# Altium schematic sheet MCU.SchDoc: VFD-Clock
size A; Author: Jack Danielski
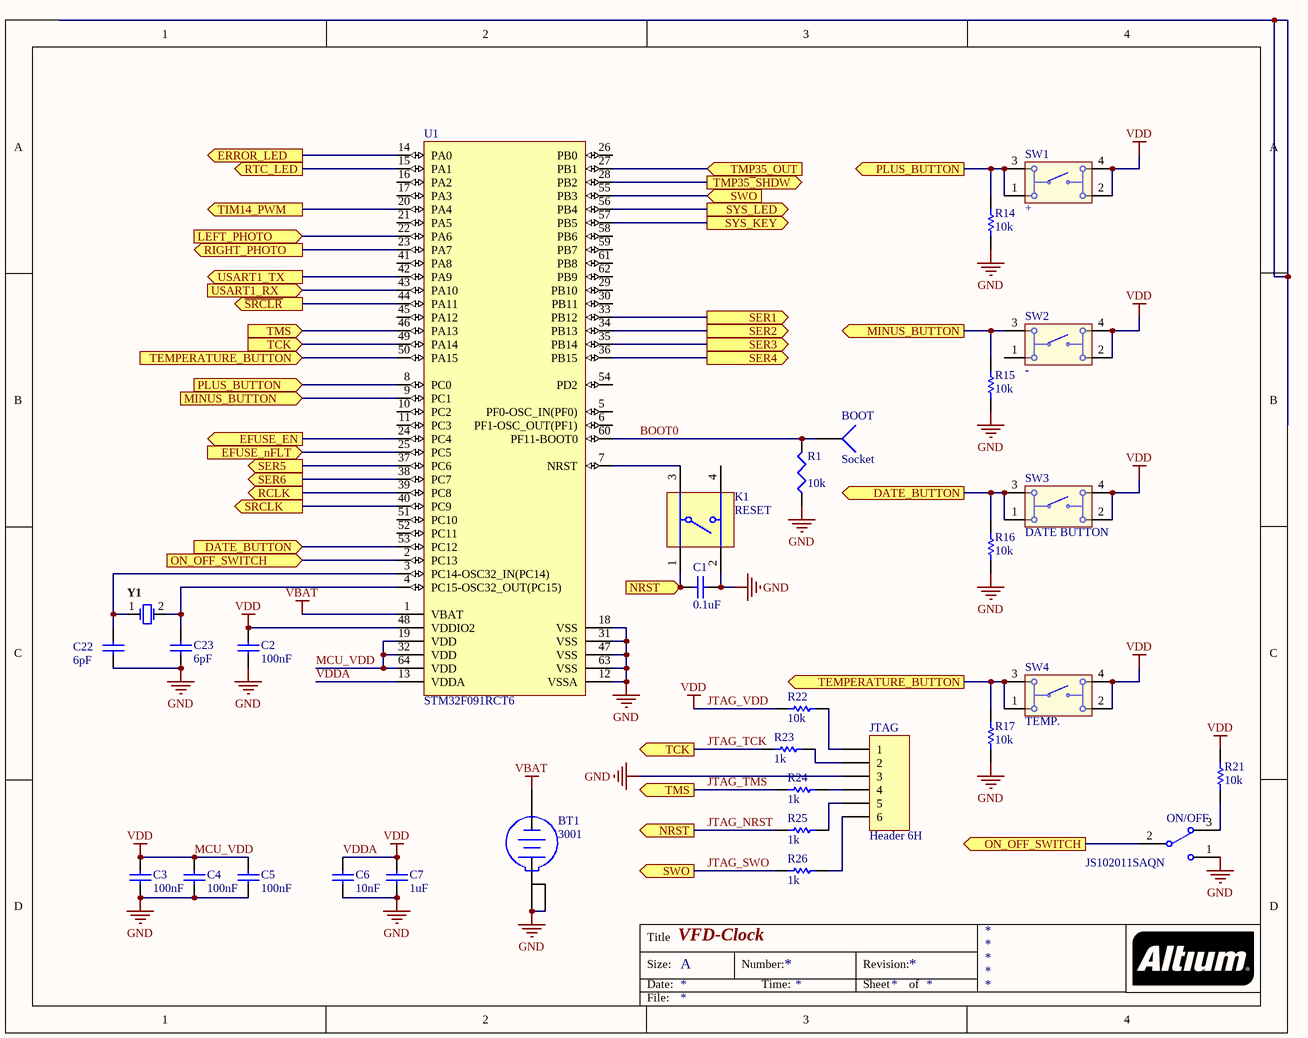
[diagram p0: MCU.SchDoc]

## Parts
BOOT  Socket  [PIN1]
BT1  3001  [KSTN-3001_V]
C1  0.1uF  [CAPC1608X90X40ML10T20]
C2  100nF  [CAPC1608X90X40ML10T20]
C3  100nF  [CAPC1608X90X40ML10T20]
C4  100nF  [CAPC1608X90X40ML10T20]
C5  100nF  [CAPC1608X90X40ML10T20]
C6  10nF  [CAPC1608X90X40ML10T20]
C7  1uF  [CAPC1608X90X20LL10]
C22  6pF  [CAPC1608X90X40ML10T20]
C23  6pF  [CAPC1608X90X40ML10T20]
JTAG  Header 6H  [HDR1X6H]
K1  RESET  [PNSC-EVPAA_V]
ON/OFF  JS102011SAQN  [CKCP-JS102011SAQN-3_V]
R1  value 10k  [J1-0603]
R14  10k  [RESC1608X55X30LL20T20]
R15  10k  [RESC1608X55X30LL20T20]
R16  10k  [RESC1608X55X30LL20T20]
R17  10k  [RESC1608X55X30LL20T20]
R21  10k  [RESC1608X55X30LL20T20]
R22  10k  [RESC1608X55X30LL20T20]
R23  1k  [RESC1608X55X30LL20T20]
R24  1k  [RESC1608X55X30LL20T20]
R25  1k  [RESC1608X55X30LL20T20]
R26  1k  [RESC1608X55X30LL20T20]
SW1  +  [434331045822]
SW2  -  [434331045822]
SW3  DATE BUTTON  [434331045822]
SW4  TEMP.  [434331045822]
U1  STM32F091RCT6  [STM-LQFP64_L]
Y1  ABS07-120-32.768KHZ-T  [ABRA-ABS07_A_V]  (value not drawn)

## Ports
DATE_BUTTON (in), DATE_BUTTON (out), EFUSE_EN (out), EFUSE_nFLT (in), ERROR_LED (out), LEFT_PHOTO (in), MINUS_BUTTON (in), MINUS_BUTTON (out), NRST (in), NRST (out), ON_OFF_SWITCH (in), ON_OFF_SWITCH (out), PLUS_BUTTON (in), PLUS_BUTTON (out), RCLK (out), RIGHT_PHOTO (out), RTC_LED (out), SER1 (out), SER2 (out), SER3 (out), SER4 (out), SER5 (out), SER6 (out), SRCLK (out), SWO (in), SWO (out), SYS_KEY (out), SYS_LED (out), TCK (in), TCK (out), TEMPERATURE_BUTTON (in), TEMPERATURE_BUTTON (out), TIM14_PWM (out), TMP35_OUT (in), TMP35~{_}SHDW (out), TMS (in), TMS (out), USART1_RX (in), USART1_TX (out), ~{SRCLR} (out)

## Nets
GND: BT1.1(+) BT1.2(+) C1.2 C2.1 C3.1 C4.1 C5.1 C6.2 C7.1 C22.1 C23.1 JTAG.3 K1.2(B) ON/OFF.1 R1.1 R14.1 R15.1 R16.1 R17.1 U1.12(VSSA) U1.18(VSS) U1.31(VSS) U1.47(VSS) U1.63(VSS)
JTAG_VDD: C2.2 C3.2 C4.2 C5.2 C6.1 C7.2 R21.2 R22.2 SW1.2 SW1.4 SW2.2 SW2.4 SW3.2 SW3.4 SW4.2 SW4.4 U1.13(VDDA) U1.19(VDD) U1.32(VDD) U1.48(VDDIO2) U1.64(VDD)  [also labelled MCU_VDD, VDD, VDDA]
VBAT: BT1.3(-) U1.1(VBAT)
~{SRCLR}: U1.44(PA11) ; port ~{SRCLR}
BOOT0: BOOT.1 R1.2 U1.60(PF11-BOOT0)
DATE_BUTTON: R16.2 SW3.1 SW3.3 U1.53(PC12) ; port DATE_BUTTON
EFUSE_EN: U1.24(PC4) ; port EFUSE_EN
EFUSE_nFLT: U1.25(PC5) ; port EFUSE_nFLT
ERROR_LED: U1.14(PA0) ; port ERROR_LED
JTAG_NRST: C1.1 K1.1(A) R25.2 ; port NRST
JTAG_SWO: R26.2 U1.55(PB3) ; port SWO
JTAG_TCK: R23.2 U1.49(PA14) ; port TCK
JTAG_TMS: R24.2 U1.46(PA13) ; port TMS
LEFT_PHOTO: U1.22(PA6) ; port LEFT_PHOTO
MINUS_BUTTON: R15.2 SW2.3 U1.9(PC1) ; port MINUS_BUTTON
ON_OFF_SWITCH: ON/OFF.2 U1.2(PC13) ; port ON_OFF_SWITCH
PLUS_BUTTON: R14.2 SW1.1 SW1.3 U1.8(PC0) ; port PLUS_BUTTON
RCLK: U1.39(PC8) ; port RCLK
RIGHT_PHOTO: U1.23(PA7) ; port RIGHT_PHOTO
RTC_LED: U1.15(PA1) ; port RTC_LED
SER1: U1.33(PB12) ; port SER1
SER2: U1.34(PB13) ; port SER2
SER3: U1.35(PB14) ; port SER3
SER4: U1.36(PB15) ; port SER4
SER5: U1.37(PC6) ; port SER5
SER6: U1.38(PC7) ; port SER6
SRCLK: U1.40(PC9) ; port SRCLK
SYS_KEY: U1.57(PB5) ; port SYS_KEY
SYS_LED: U1.56(PB4) ; port SYS_LED
TEMPERATURE_BUTTON: R17.2 SW4.1 SW4.3 U1.50(PA15) ; port TEMPERATURE_BUTTON
TIM14_PWM: U1.20(PA4) ; port TIM14_PWM
TMP35~{_}SHDW: U1.28(PB2) ; port TMP35~{_}SHDW
TMP35_OUT: U1.27(PB1) ; port TMP35_OUT
USART1_RX: U1.43(PA10) ; port USART1_RX
USART1_TX: U1.42(PA9) ; port USART1_TX
NetC22_2: C22.2 U1.3(PC14-OSC32_IN(PC14)) Y1.1
NetC23_2: C23.2 U1.4(PC15-OSC32_OUT(PC15)) Y1.2
NetJTAG_1: JTAG.1 R22.1
NetJTAG_2: JTAG.2 R23.1
NetJTAG_4: JTAG.4 R24.1
NetJTAG_5: JTAG.5 R25.1
NetJTAG_6: JTAG.6 R26.1
NetK1_3: K1.3(A') U1.7(NRST)
NetON/OFF_3: ON/OFF.3 R21.1

Not connected (* = marked no-connect by the designer): K1 4(B'); SW2 1; U1 5(PF0-OSC_IN(PF0)) 6(PF1-OSC_OUT(PF1)) 10(PC2) 11(PC3) 16(PA2) 17(PA3) 21(PA5) 26(PB0) 29(PB10) 30(PB11) 41(PA8) 45(PA12) 51(PC10) 52(PC11) 54(PD2) 58(PB6) 59(PB7) 61(PB8) 62(PB9)

## Notes on the sheet
- Title
- Size:
- Date:
- A
- Number:
- Time:
- Revision:
- Sheet
- of
- File:

## Library data of the parts
BT1 = CMP-2000-05463-1: Holder Battery Coin, 12 mm, 2-Pin THD, RoHS; Manufacturer: Keystone; Package Reference: 3001; Package Description: 2-Pin Through Hole Device, Body 13.21 x 12.07 mm; Datasheet Version: Rev. H, 09/2006; Datasheet URL: https://datasheet.ciiva.com/3/3001-3954.pdf; Mounting Technology: ThroughHole; Manufacturer URL: http://www.keyelco.com/
C1-C5 C22 C23 = CMP-2000-05002-1: Ceramic Multilayer Capacitor, 100 nF, +/- 10%, 50 V, -55 to 155 degC, 0603 (1608 Metric), RoHS, Tape and Reel; Manufacturer: Yageo; Online Catalog: CCSeries; Voltage - Rated: 16V; Product Training Modules: MultilayerCeramicCapacitors; Other Names: 311-1088-6; Featured Product: CommodityMultilayerCeramicCapacitors–CCSeries; Capacitance: 0.1µF; Temperature Coefficient: X7R; Height - Seated (Max): -; Operating Temperature: -55degC~125degC; Package / Case: 0603(1608Metric); Datasheet URL: https://datasheet.ciiva.com/11786/0900766b80d84f1d-11786077.pdf; Package Description: 2-Pin Surface Mount Device, Body 1.6 x 0.8 mm; Family: CeramicCapacitors; Packaging: Digi-Reel; Size / Dimension: 0.063"Lx0.031"W(1.60mmx0.80mm); Thickness (Max): 0.035"(0.90mm); Series: CC; Lead Spacing: -; Features: -; Tolerance: ±10%; Lead Style: -; Ratings: -; Manufacturer URL: http://www.yageo.com/; Package Reference: 603; Standard Package: 1; Category: Capacitors; Mounting Type: SurfaceMount,MLCC; Applications: GeneralPurpose; Datasheet Version: Rev. 2, 05/2009
C6 = CMP-2100-03600-1: Chip Capacitor, 10 nF, +/- 10%, 50 V, -55 to 125 degC, 0603 (1608 Metric), RoHS, Tape and Reel; Manufacturer: Yageo; Insulation Resistance: 100GR; Dielectric: X7R; Voltage Rating (DC): 50V; Material: Ceramic; Lead Free: LeadFree; Case/Package: 0603; Datasheet Version: Rev. 15, 10/2016; Composition: Ceramic; Radiation Hardening: No; Thickness: 0.035inch; RoHSCompliant: True; Termination: SMD/SMT; Capacitance: 10nF; Manufacturer URL: http://www.yageo.com/; Tolerance: 10%; REACH SVHC: NoSVHC; Voltage: 50V; Max Operating Temperature: 125degC; Case Code (Metric): 1608; Package Quantity: 1; Case Code (Imperial): 0603; Packaging: TapeandReel; Package Reference: 0603; Width: 0.031inch; Datasheet URL: http://www.yageo.com/documents/recent/UPY-GPHC_X7R_6.3V-to-50V_15.pdf; Length: 1.6mm; Min Operating Temperature: -55degC; Number of Pins: 2; Depth: 0.8mm; Mount: SurfaceMount; Height: 0.8mm; Voltage Rating: 50V; Package Description: 2-Pin Surface Mount Device, Body 1.6 x 0.8 mm
C7 = CMP-2000-06025-1: Chip Capacitor, 1 uF, +/- 10%, 50 V, -55 to 85 degC, 0603 (1608 Metric), RoHS, Tape and Reel; Manufacturer: TDK; PCN Part Number: MLCCPartNumberChange30/Nov/2012; Other Names: 445-7468-6; Online Catalog: CSeries,GeneralPurpose; Capacitance: 1µF; Product Training Modules: CSeriesGeneralApplicationsSEAT,CCV,andTVCLDesignToolsGuidetoReplacinganElectrolyticCapacitorwithanMLCC; Voltage - Rated: 50V; Design Resources: 20WNon-IsolatedBuckLEDDriverUsingPLLNK460KG; Temperature Coefficient: X5R; Series: C; Datasheet Version: 08/2016; Package Description: 2-Pin Surface Mount Device, Body 1.6 x 0.8 mm; Mounting Technology: SurfaceMount; Features: -; Size / Dimension: 0.063"Lx0.031"W(1.60mmx0.80mm); Lead Spacing: -; Operating Temperature: -55°C~85°C; Tolerance: ±10%; Height - Seated (Max): -; Mounting Type: SurfaceMount,MLCC; Ratings: -; Standard Package: 1; Applications: GeneralPurpose; Datasheet URL: https://product.tdk.com/info/en/catalog/datasheets/mlcc_commercial_general_en.pdf; Category: Capacitors; Lead Style: -; Packaging: Digi-Reel®; RoHS Information: RoHSCertificate-MLCC; Package / Case: 0603(1608Metric); Package Reference: 0603; Manufacturer URL: http://www.tdk.com/; Thickness (Max): 0.035"(0.90mm); Family: CeramicCapacitors
JTAG = Header 6H: Header, 6-Pin, Right Angle; LatestRevisionDate: 17-Jul-2002; LatestRevisionNote: Re-released for DXP Platform.; Publisher: Altium Limited
K1 = CMP-2000-06231-1: Light Touch Switch, 100 mOhm, -40 to 85 degC, 4-Pin SMD, RoHS, Tape and Reel; Manufacturer: Panasonic; Part No: EVP-AA002K; Electrical Life: 1000000Cycles; Switch Configuration: N.O.; COO: JP; Actuator Color: Black; Contact Rating @ Voltage: 0.02@15VDCA; Dielectric Strength: 250VAC; Actuator Length: 0.3mm; Ground Terminal: No; Operating Force: 1N; Pole Throw Configuration: SPST; Body Orientation: Straight; Illumination Type: N/R; Maximum DC Voltage Rating: 15V; Actuator Style: RectangularButton; Maximum AC Voltage Rating: N/A; Package Description: 4-Pin Surface Mount Device, Body 2.9 x 3.5 mm, Pitch 1.45 mm; Family: EVPAA; Contact Material: N/A; Mounting: SurfaceMount,J-Bend; Datasheet Version: 04/2016; Housing Material: N/A; Product Weight: N/A; RoHS: Yes; Mechanical Life: N/A; Minimum Insulation Resistance: 100MOhm; Operating Temperature: -40to85C; Mounting Technology: SurfaceMount; HTS: 8507204000; Dimension: 4.3x2.9x1.7mm; Maximum Contact Resistance: 100mOhm; Base Material: N/A; Seal Location: N/A; Supplier Standard Pack: 5,000; Supplier: PanasonicIndustrialDevices; Datasheet URL: https://industrial.panasonic.com/cdbs/www-data/pdf/ATV0000/ATV0000C1.pdf; Packaging: EmbossedTapeandReel; Manufacturer URL: http://www.panasonic.com/; Seal Description: N/A; Contact Plating: N/A; ECCN: EAR99; Package Reference: EVPAA; Type: LightTouch
ON/OFF = CMP-2000-06501-1: Sub-Miniature Slide Switch, SPDT, -40 to 85 degC, 3-Pin SMD, RoHS, Tape and Reel; Manufacturer: C&K Components; Electrical Life: 15000Cycles; Actuator Color: Black; Body Orientation: RightAngle; Minimum Insulation Resistance: 100MOhm; Contact Rating @ Voltage: 0.3@6VDCA; Actuator Style: SideSlide; Maximum DC Voltage Rating: 6V; COO: US; Actuator Material: Nylon4/6; Dielectric Strength: 500VAC; Maximum Contact Resistance: 70mOhm; Base Material: N/A; Mounting Technology: SurfaceMount; Switch Configuration: N/A; Package Reference: SMT; Package Description: 3-Pin Surface Mount Device, Body 9 x 3.6 mm, Height 3.5 mm; Mounting: SurfaceMount,GullWing; Part No: JS102011SAQN; Dimension: 9x4.3mm; Type: Sub-Miniature; Product Weight: N/A; Seal Location: N/A; Family: JS; ECCN: EAR99; Supplier: C&KComponents; Seal Description: N/A; Contact Plating: Silver; Pole Throw Configuration: SPDT; Packaging: TapeandReel; Manufacturer URL: http://www.ckswitches.com/; Datasheet URL: https://datasheet.ciiva.com/1532/js-9dec14-1532400.pdf; Maximum AC Voltage Rating: N/A; Mechanical Life: N/A; HTS: 8536509050; Datasheet Version: 12/2014; Housing Material: Nylon4/6; Contact Material: CopperAlloy; RoHS: Yes; Operating Temperature: -40to85C
R1 = Res3: Resistor; Published: 8-Jun-2000; LatestRevisionDate: 29-May-2009; LatestRevisionNote: IPC-7351 Footprint Added.; PackageReference: J1-0603; Publisher: Altium Limited; PackageDescription: Chip Resistor
R14-R17 R21-R26 = CMP-2000-00873-1: Manufacturer: Panasonic; Part Number: ERA3AEB102V
SW1-SW4 = CMP-1461-00001-1: WS-TASU SMD Tact Switch 4.7X3.5 mm side push; Manufacturer: Wuerth Elektronik; NoPins: 04; ComponentLink1Description: Manufacturer URL; ComponentLink2Description: Datasheet; PartNumber: 434331045822; PackageReference: 434331045822; ComponentLink2URL: http://katalog.we-online.de/em/datasheet/434331045822.pdf; ComponentLink1URL: http://www.we-online.com
U1 = CMP-0304-00199-2: ARM Cortex-M0 32-bit MCU, 256 KB Flash, 32 KB Internal RAM, 52 I/Os, 64-Pin LQFP, -40 to 85 degC, Tray; Manufacturer: STMicroelectronics; I/Os (High Current): 52; FLASH Size (Prog) (kB): 256; Operating Frequency(F) (Processor speed) (MHz): 48; D/A Converter: 1; Supply Voltage(Vcc) min (V): 2; Internal RAM Size (kB): 32; ComponentLink2Description: Datasheet; ComponentLink1Description: Manufacturer URL; Package Reference: LQFP64; Core: ARM Cortex-M0; PartNumber: STM32F091RCT6; Package Description: 64-Pin Low-profile Quad Flat Package, Body 10 x 10 mm, Pitch 0.5 mm; ComponentLink1URL: http://www.st.com/; ComponentLink2URL: http://www.st.com/st-web-ui/static/active/en/resource/technical/document/datasheet/DM00115237.pdf; DatasheetVersion: Rev. 2; Mounting Technology: Surface Mount; Packing: Tray
Y1 = CMP-2000-07587-1: Tuning Fork Crystal, 32.768 KHz, +/- 20 ppm, -40 to 85 degC, 2-Pin SMD, RoHS, Tape and Reel; Manufacturer: Abracon; Case\/Package: SMD/SMT; Series Resistance: 60KOhm; Frequency Tolerance: 20ppm; Load Capacitance: 6pF; ESR (Equivalent Series Resistance): 55KOhm; Max Operating Temperature: 85degC; Width: 0.061inch; Radiation Hardening: No; Lead Free: LeadFree; RoHSCompliant: True; Depth: 1.5mm; Datasheet URL: http://www.abracon.com/Resonators/ABS07-120-32.768kHz-T.pdf; Frequency: 32.768KHz; Termination: SMD/SMT; Manufacturer URL: http://www.abracon.com/; Package Quantity: 3000; Packaging: TapeandReel; Number of Pins: 2; Height: 0.035inch; Package Description: 2-Pin Surface Mount Device, Body 3.2 x 1.5 mm; Package Reference: ABS07; Mount: SurfaceMount; Tolerance: 20ppm; Mounting Technology: SurfaceMount; REACH SVHC: NoSVHC; Datasheet Version: 11/2014; Length: 3.2mm; Min Operating Temperature: -40degC
BOOT = Socket: LatestRevisionDate: 17-Jul-2002; LatestRevisionNote: Re-released for DXP Platform.; Publisher: Altium Limited